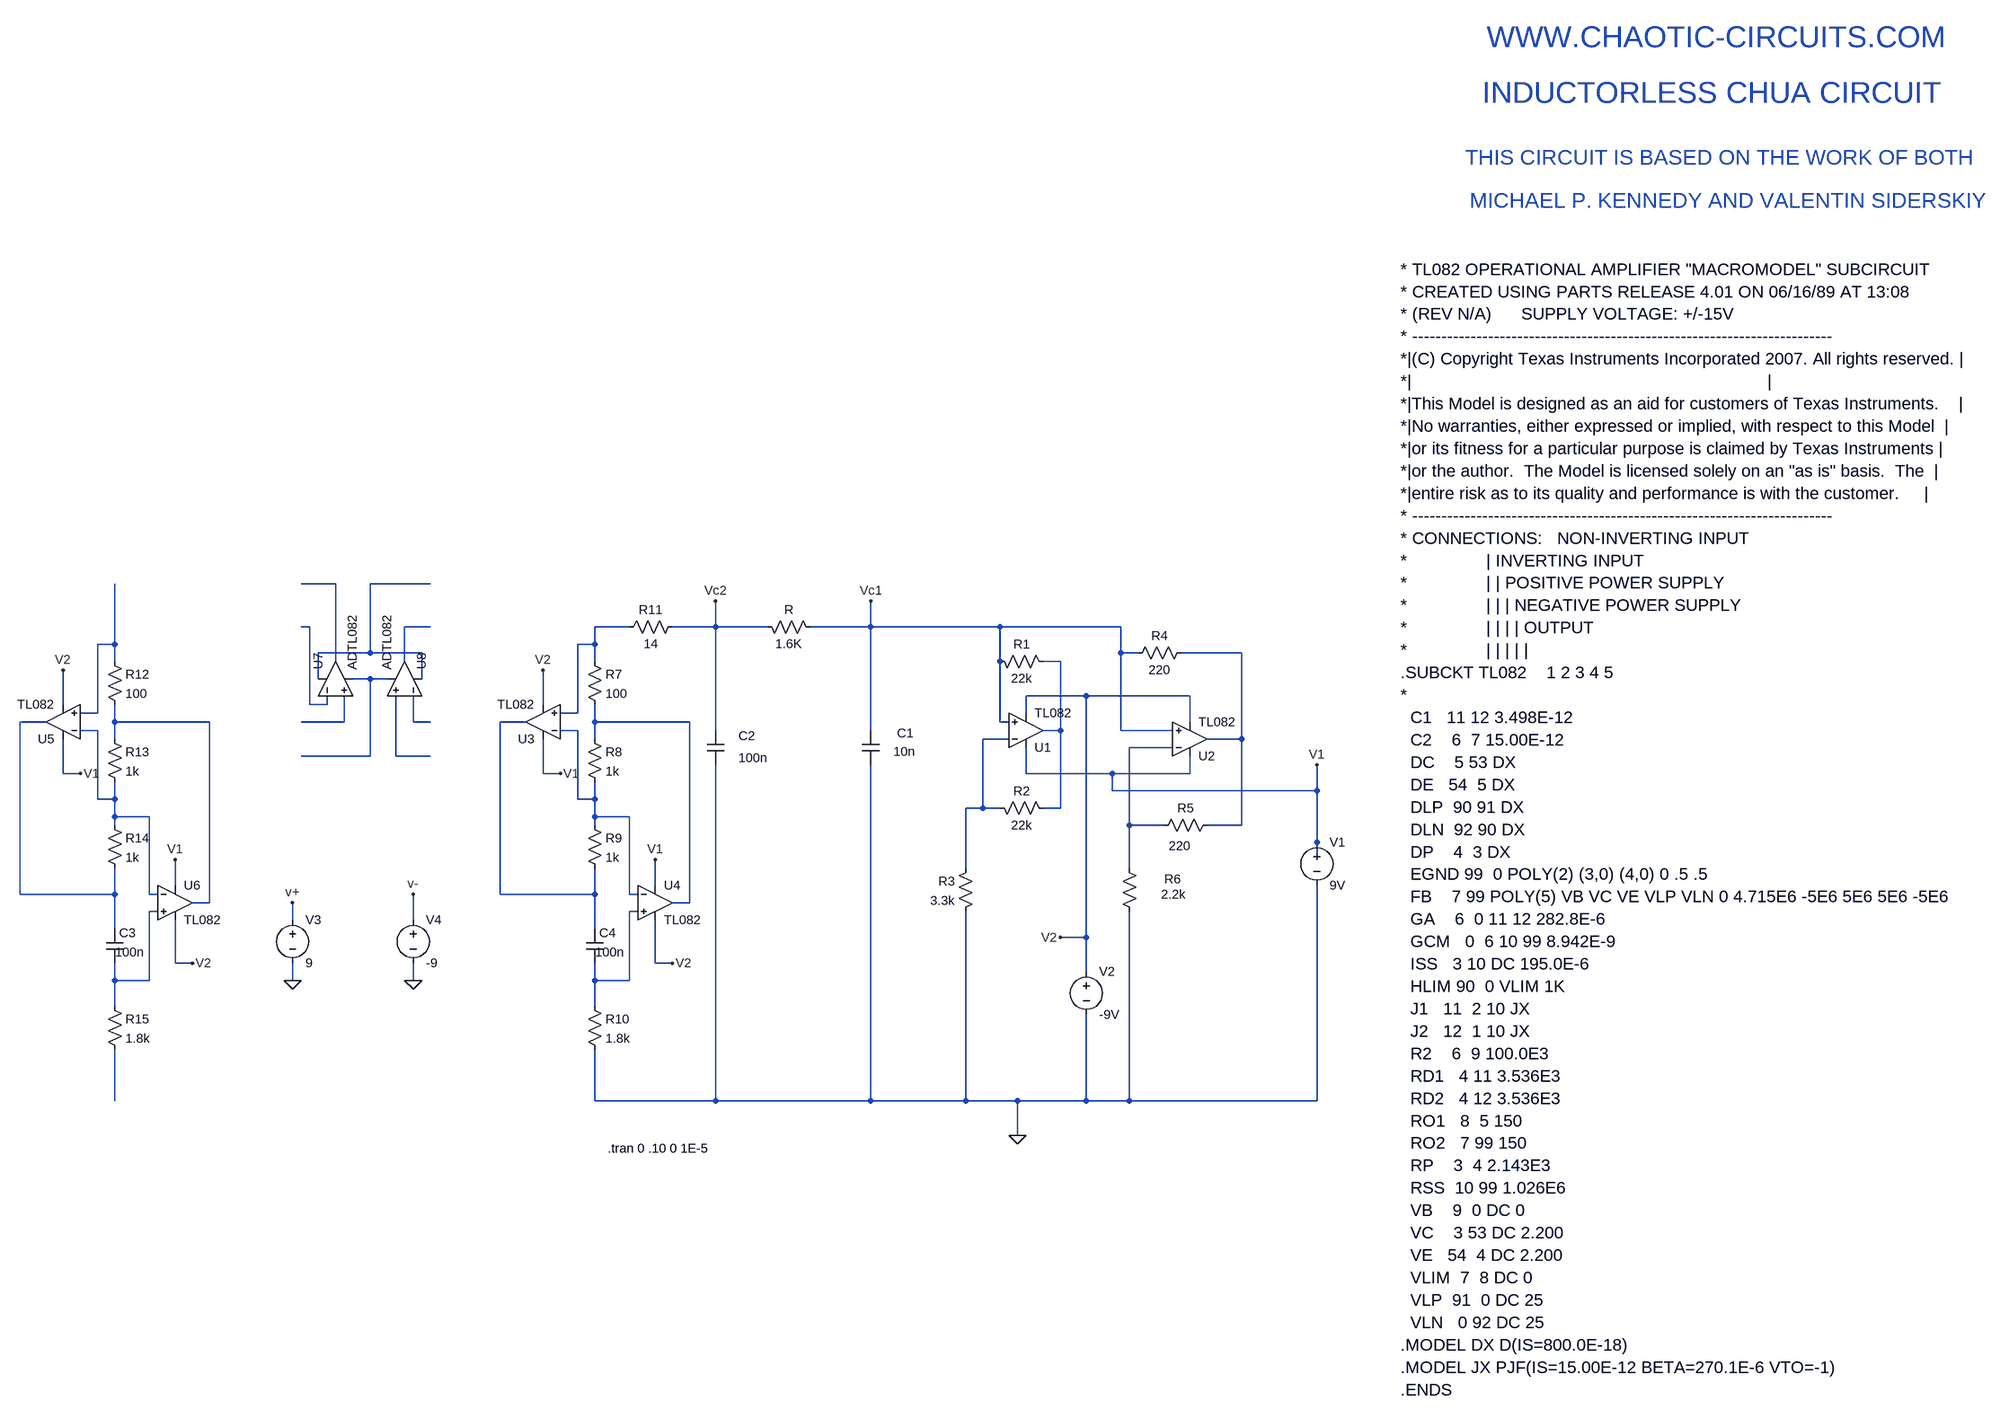
[diagram p0: schematic INDUCTORLESS_CHAU_TL082.asc]
INDUCTORLESS_CHAU_TL082.asc, the LTspice schematic file:
Version 4.1
SHEET 1 1280 2032
WIRE -3520 -208 -3584 -208
WIRE -3344 -208 -3456 -208
WIRE -3568 -128 -3584 -128
WIRE -3344 -128 -3392 -128
WIRE -2400 -128 -2464 -128
WIRE -2240 -128 -2240 -176
WIRE -2240 -128 -2320 -128
WIRE -2144 -128 -2240 -128
WIRE -1952 -128 -1952 -176
WIRE -1952 -128 -2064 -128
WIRE -1712 -128 -1952 -128
WIRE -1488 -128 -1712 -128
WIRE -3968 -96 -3968 -208
WIRE -3968 -96 -4000 -96
WIRE -2464 -96 -2464 -128
WIRE -2464 -96 -2496 -96
WIRE -3456 -80 -3456 -208
WIRE -3456 -80 -3552 -80
WIRE -3360 -80 -3456 -80
WIRE -1488 -80 -1488 -128
WIRE -1456 -80 -1488 -80
WIRE -1264 -80 -1376 -80
WIRE -3968 -64 -3968 -96
WIRE -3520 -64 -3520 -208
WIRE -3392 -64 -3392 -128
WIRE -2464 -64 -2464 -96
WIRE -1712 -64 -1712 -128
WIRE -1600 -64 -1632 -64
WIRE -3552 -32 -3552 -80
WIRE -3456 -32 -3488 -32
WIRE -3424 -32 -3456 -32
WIRE -3360 -32 -3360 -80
WIRE -1552 0 -1664 0
WIRE -1360 0 -1552 0
WIRE -4064 16 -4064 -48
WIRE -3568 16 -3568 -128
WIRE -3536 16 -3536 0
WIRE -3536 16 -3568 16
WIRE -2560 16 -2560 -48
WIRE -4000 32 -4000 -96
WIRE -4000 32 -4032 32
WIRE -2496 32 -2496 -96
WIRE -2496 32 -2528 32
WIRE -1664 32 -1664 0
WIRE -4096 48 -4144 48
WIRE -3968 48 -3968 16
WIRE -3792 48 -3968 48
WIRE -3504 48 -3504 0
WIRE -3504 48 -3584 48
WIRE -3376 48 -3376 0
WIRE -3344 48 -3376 48
WIRE -2592 48 -2640 48
WIRE -2464 48 -2464 16
WIRE -2288 48 -2464 48
WIRE -1712 48 -1712 -64
WIRE -1696 48 -1712 48
WIRE -1360 48 -1360 0
WIRE -4000 64 -4032 64
WIRE -2496 64 -2528 64
WIRE -2240 64 -2240 -128
WIRE -1952 64 -1952 -128
WIRE -1600 64 -1600 -64
WIRE -1600 64 -1632 64
WIRE -1488 64 -1488 -80
WIRE -1392 64 -1488 64
WIRE -3968 80 -3968 48
WIRE -2464 80 -2464 48
WIRE -1696 80 -1744 80
WIRE -1264 80 -1264 -80
WIRE -1264 80 -1328 80
WIRE -1392 96 -1472 96
WIRE -3456 112 -3456 -32
WIRE -3456 112 -3584 112
WIRE -3408 112 -3408 0
WIRE -3344 112 -3408 112
WIRE -4064 144 -4064 80
WIRE -4032 144 -4064 144
WIRE -2560 144 -2560 80
WIRE -2528 144 -2560 144
WIRE -1664 144 -1664 96
WIRE -1504 144 -1664 144
WIRE -1360 144 -1360 112
WIRE -1360 144 -1504 144
WIRE -1504 176 -1504 144
WIRE -1056 176 -1056 128
WIRE -1056 176 -1504 176
WIRE -4000 192 -4000 64
WIRE -3968 192 -3968 160
WIRE -3968 192 -4000 192
WIRE -2496 192 -2496 64
WIRE -2464 192 -2464 160
WIRE -2464 192 -2496 192
WIRE -1744 208 -1744 80
WIRE -1744 208 -1776 208
WIRE -1712 208 -1744 208
WIRE -1600 208 -1600 64
WIRE -1600 208 -1632 208
WIRE -3968 224 -3968 192
WIRE -3904 224 -3968 224
WIRE -2464 224 -2464 192
WIRE -2400 224 -2464 224
WIRE -3968 240 -3968 224
WIRE -2464 240 -2464 224
WIRE -1472 240 -1472 96
WIRE -1408 240 -1472 240
WIRE -1264 240 -1264 80
WIRE -1264 240 -1328 240
WIRE -1056 272 -1056 176
WIRE -1056 304 -1056 272
WIRE -1776 320 -1776 208
WIRE -1472 320 -1472 240
WIRE -3856 352 -3856 304
WIRE -2352 352 -2352 304
WIRE -4144 368 -4144 48
WIRE -3968 368 -3968 320
WIRE -3968 368 -4144 368
WIRE -3904 368 -3904 224
WIRE -3888 368 -3904 368
WIRE -2640 368 -2640 48
WIRE -2464 368 -2464 320
WIRE -2464 368 -2640 368
WIRE -2400 368 -2400 224
WIRE -2384 368 -2400 368
WIRE -3792 384 -3792 48
WIRE -3792 384 -3824 384
WIRE -2288 384 -2288 48
WIRE -2288 384 -2320 384
WIRE -3888 400 -3904 400
WIRE -2384 400 -2400 400
WIRE -3600 416 -3600 384
WIRE -3376 416 -3376 368
WIRE -3968 432 -3968 368
WIRE -2464 432 -2464 368
WIRE -1552 448 -1552 0
WIRE -1552 448 -1600 448
WIRE -3856 496 -3856 416
WIRE -3824 496 -3856 496
WIRE -2352 496 -2352 416
WIRE -2320 496 -2352 496
WIRE -1552 512 -1552 448
WIRE -3968 528 -3968 496
WIRE -3904 528 -3904 400
WIRE -3904 528 -3968 528
WIRE -3600 528 -3600 496
WIRE -3376 528 -3376 496
WIRE -2464 528 -2464 496
WIRE -2400 528 -2400 400
WIRE -2400 528 -2464 528
WIRE -3968 576 -3968 528
WIRE -2464 576 -2464 528
WIRE -3968 752 -3968 656
WIRE -2464 752 -2464 656
WIRE -2240 752 -2240 128
WIRE -2240 752 -2464 752
WIRE -1952 752 -1952 128
WIRE -1952 752 -2240 752
WIRE -1776 752 -1776 400
WIRE -1776 752 -1952 752
WIRE -1680 752 -1776 752
WIRE -1552 752 -1552 592
WIRE -1552 752 -1680 752
WIRE -1472 752 -1472 400
WIRE -1472 752 -1552 752
WIRE -1056 752 -1056 352
WIRE -1056 752 -1472 752
WIRE -1680 816 -1680 752
FLAG -1680 816 0
FLAG -1952 -176 Vc1
FLAG -2240 -176 Vc2
FLAG -1056 128 V1
FLAG -1600 448 V2
FLAG -4064 -48 V2
FLAG -3824 496 V2
FLAG -4032 144 V1
FLAG -3856 304 V1
FLAG -3600 528 0
FLAG -3376 528 0
FLAG -3600 384 v+
FLAG -3376 368 v-
FLAG -2560 -48 V2
FLAG -2320 496 V2
FLAG -2528 144 V1
FLAG -2352 304 V1
SYMBOL res -1472 -64 R270
WINDOW 0 32 56 VTop 2
WINDOW 3 0 56 VBottom 2
SYMATTR InstName R4
SYMATTR Value 220
SYMATTR SpiceLine tol=5 pwr=1
SYMBOL res -1424 256 R270
WINDOW 0 32 56 VTop 2
WINDOW 3 -7 45 VBottom 2
SYMATTR InstName R5
SYMATTR Value 220
SYMATTR SpiceLine tol=5 pwr=1
SYMBOL res -1488 304 R0
WINDOW 0 81 36 Left 2
WINDOW 3 75 64 Left 2
SYMATTR InstName R6
SYMATTR Value 2.2k
SYMATTR SpiceLine tol=5 pwr=1
SYMBOL res -1616 -48 M270
WINDOW 0 32 56 VTop 2
WINDOW 3 0 56 VBottom 2
SYMATTR InstName R1
SYMATTR Value 22k
SYMATTR SpiceLine tol=5 pwr=1
SYMBOL res -1616 224 M270
WINDOW 0 32 56 VTop 2
WINDOW 3 0 56 VBottom 2
SYMATTR InstName R2
SYMATTR Value 22k
SYMATTR SpiceLine tol=5 pwr=1
SYMBOL res -1760 304 M0
SYMATTR InstName R3
SYMATTR Value 3.3k
SYMATTR SpiceLine tol=5 pwr=1
SYMBOL res -2048 -112 M270
WINDOW 0 32 56 VTop 2
WINDOW 3 0 56 VBottom 2
SYMATTR InstName R
SYMATTR Value 1.6K
SYMATTR SpiceLine tol=5 pwr=1
SYMBOL cap -1968 64 R0
WINDOW 0 65 5 Left 2
WINDOW 3 58 39 Left 2
SYMATTR InstName C1
SYMATTR Value 10n
SYMATTR SpiceLine V=100
SYMBOL cap -2256 64 R0
WINDOW 0 59 10 Left 2
WINDOW 3 59 51 Left 2
SYMATTR InstName C2
SYMATTR Value 100n
SYMATTR SpiceLine V=100
SYMBOL voltage -1056 256 R0
WINDOW 123 0 0 Left 2
WINDOW 39 24 124 Left 2
SYMATTR InstName V1
SYMATTR Value 9V
SYMBOL voltage -1552 496 R0
WINDOW 123 0 0 Left 2
WINDOW 39 24 124 Left 2
SYMATTR InstName V2
SYMATTR Value -9V
SYMBOL Opamps\\opamp2 -1664 128 M180
SYMATTR InstName U1
SYMATTR Value TL082
SYMBOL Opamps\\opamp2 -1360 144 M180
SYMATTR InstName U2
SYMATTR Value TL082
SYMBOL res -2304 -144 R90
WINDOW 0 0 56 VBottom 2
WINDOW 3 32 56 VTop 2
SYMATTR InstName R11
SYMATTR Value 14
SYMBOL OpAmps\\ADTL082 -3584 -32 R270
SYMATTR InstName U7
SYMBOL OpAmps\\ADTL082 -3328 -32 M270
SYMATTR InstName U8
SYMBOL res -3984 -80 R0
SYMATTR InstName R12
SYMATTR Value 100
SYMBOL res -3984 64 R0
SYMATTR InstName R13
SYMATTR Value 1k
SYMBOL res -3984 224 R0
SYMATTR InstName R14
SYMATTR Value 1k
SYMBOL res -3984 560 R0
SYMATTR InstName R15
SYMATTR Value 1.8k
SYMBOL cap -3984 432 R0
WINDOW 3 17 44 Left 2
SYMATTR Value 100n
SYMATTR InstName C3
SYMBOL Opamps\\opamp2 -4064 112 R180
SYMATTR InstName U5
SYMATTR Value TL082
SYMBOL Opamps\\opamp2 -3856 320 R0
SYMATTR InstName U6
SYMATTR Value TL082
SYMBOL voltage -3600 400 R0
WINDOW 123 0 0 Left 0
WINDOW 39 0 0 Left 0
SYMATTR InstName V3
SYMATTR Value 9
SYMBOL voltage -3376 400 R0
WINDOW 123 0 0 Left 0
WINDOW 39 0 0 Left 0
SYMATTR InstName V4
SYMATTR Value -9
SYMBOL res -2480 -80 R0
SYMATTR InstName R7
SYMATTR Value 100
SYMBOL res -2480 64 R0
SYMATTR InstName R8
SYMATTR Value 1k
SYMBOL res -2480 224 R0
SYMATTR InstName R9
SYMATTR Value 1k
SYMBOL res -2480 560 R0
SYMATTR InstName R10
SYMATTR Value 1.8k
SYMBOL cap -2480 432 R0
WINDOW 3 17 44 Left 2
SYMATTR Value 100n
SYMATTR InstName C4
SYMBOL Opamps\\opamp2 -2560 112 R180
SYMATTR InstName U3
SYMATTR Value TL082
SYMBOL Opamps\\opamp2 -2352 320 R0
SYMATTR InstName U4
SYMATTR Value TL082
TEXT -2440 840 Left 2 !.tran 0 .10 0 1E-5
TEXT -384 -1272 Left 5 ;WWW.CHAOTIC-CIRCUITS.COM
TEXT -544 -792 Left 3 !* TL082 OPERATIONAL AMPLIFIER "MACROMODEL" SUBCIRCUIT\n* CREATED USING PARTS RELEASE 4.01 ON 06/16/89 AT 13:08\n* (REV N/A)      SUPPLY VOLTAGE: +/-15V\n* ------------------------------------------------------------------------\n*|(C) Copyright Texas Instruments Incorporated 2007. All rights reserved. |\n*|                                                                        |\n*|This Model is designed as an aid for customers of Texas Instruments.    |\n*|No warranties, either expressed or implied, with respect to this Model  |\n*|or its fitness for a particular purpose is claimed by Texas Instruments |\n*|or the author.  The Model is licensed solely on an "as is" basis.  The  |\n*|entire risk as to its quality and performance is with the customer.     |\n* ------------------------------------------------------------------------\n* CONNECTIONS:   NON-INVERTING INPUT\n*                | INVERTING INPUT\n*                | | POSITIVE POWER SUPPLY\n*                | | | NEGATIVE POWER SUPPLY\n*                | | | | OUTPUT\n*                | | | | |\n.SUBCKT TL082    1 2 3 4 5\n*\n  C1   11 12 3.498E-12\n  C2    6  7 15.00E-12\n  DC    5 53 DX\n  DE   54  5 DX\n  DLP  90 91 DX\n  DLN  92 90 DX\n  DP    4  3 DX\n  EGND 99  0 POLY(2) (3,0) (4,0) 0 .5 .5\n  FB    7 99 POLY(5) VB VC VE VLP VLN 0 4.715E6 -5E6 5E6 5E6 -5E6\n  GA    6  0 11 12 282.8E-6\n  GCM   0  6 10 99 8.942E-9\n  ISS   3 10 DC 195.0E-6\n  HLIM 90  0 VLIM 1K\n  J1   11  2 10 JX\n  J2   12  1 10 JX\n  R2    6  9 100.0E3\n  RD1   4 11 3.536E3\n  RD2   4 12 3.536E3\n  RO1   8  5 150\n  RO2   7 99 150\n  RP    3  4 2.143E3\n  RSS  10 99 1.026E6\n  VB    9  0 DC 0\n  VC    3 53 DC 2.200\n  VE   54  4 DC 2.200\n  VLIM  7  8 DC 0\n  VLP  91  0 DC 25\n  VLN   0 92 DC 25\n.MODEL DX D(IS=800.0E-18)\n.MODEL JX PJF(IS=15.00E-12 BETA=270.1E-6 VTO=-1)\n.ENDS
TEXT -392 -1168 Left 5 ;INDUCTORLESS CHUA CIRCUIT
TEXT -424 -1048 Left 4 ;THIS CIRCUIT IS BASED ON THE WORK OF BOTH
TEXT -416 -968 Left 4 ;MICHAEL P. KENNEDY AND VALENTIN SIDERSKIY

The netlist it stands for:
* INDUCTORLESS_CHAU_TL082.asc
R4 Vc1 N007 220 tol=5 pwr=1
R5 N019 N007 220 tol=5 pwr=1
R6 N019 0 2.2k tol=5 pwr=1
R1 N008 Vc1 22k tol=5 pwr=1
R2 N008 N018 22k tol=5 pwr=1
R3 N018 0 3.3k tol=5 pwr=1
R Vc1 Vc2 1.6K tol=5 pwr=1
C1 Vc1 0 10n V=100
C2 Vc2 0 100n V=100
V1 V1 0 9V
V2 V2 0 -9V
X§U1 Vc1 N018 V1 V2 N008 TL082  ; pins In+ In- V+ V- OUT
X§U2 Vc1 N019 V1 V2 N007 TL082  ; pins In+ In- V+ V- OUT
R11 Vc2 N005 14
X§U7 N012 N003 N002 N009 N001 ADTL082  ; pins In+ In- V+ V- OUT
X§U8 N020 N013 N002 N009 N004 ADTL082  ; pins In+ In- V+ V- OUT
R12 N006 N011 100
R13 N011 N016 1k
R14 N016 N010 1k
R15 N021 N023 1.8k
C3 N010 N021 100n
X§U5 N006 N016 V1 V2 N010 TL082  ; pins In+ In- V+ V- OUT
X§U6 N021 N016 V1 V2 N011 TL082  ; pins In+ In- V+ V- OUT
V3 v+ 0 9
V4 v- 0 -9
R7 N005 N015 100
R8 N015 N017 1k
R9 N017 N014 1k
R10 N022 0 1.8k
C4 N014 N022 100n
X§U3 N005 N017 V1 V2 N014 TL082  ; pins In+ In- V+ V- OUT
X§U4 N022 N017 V1 V2 N015 TL082  ; pins In+ In- V+ V- OUT
.tran 0 .10 0 1E-5
* WWW.CHAOTIC-CIRCUITS.COM
* TL082 OPERATIONAL AMPLIFIER "MACROMODEL" SUBCIRCUIT
* CREATED USING PARTS RELEASE 4.01 ON 06/16/89 AT 13:08
* (REV N/A)      SUPPLY VOLTAGE: +/-15V
* ------------------------------------------------------------------------
*|(C) Copyright Texas Instruments Incorporated 2007. All rights reserved. |
*|                                                                        |
*|This Model is designed as an aid for customers of Texas Instruments.    |
*|No warranties, either expressed or implied, with respect to this Model  |
*|or its fitness for a particular purpose is claimed by Texas Instruments |
*|or the author.  The Model is licensed solely on an "as is" basis.  The  |
*|entire risk as to its quality and performance is with the customer.     |
* ------------------------------------------------------------------------
* CONNECTIONS:   NON-INVERTING INPUT
*                | INVERTING INPUT
*                | | POSITIVE POWER SUPPLY
*                | | | NEGATIVE POWER SUPPLY
*                | | | | OUTPUT
*                | | | | |
.SUBCKT TL082    1 2 3 4 5
*
  C1   11 12 3.498E-12
  C2    6  7 15.00E-12
  DC    5 53 DX
  DE   54  5 DX
  DLP  90 91 DX
  DLN  92 90 DX
  DP    4  3 DX
  EGND 99  0 POLY(2) (3,0) (4,0) 0 .5 .5
  FB    7 99 POLY(5) VB VC VE VLP VLN 0 4.715E6 -5E6 5E6 5E6 -5E6
  GA    6  0 11 12 282.8E-6
  GCM   0  6 10 99 8.942E-9
  ISS   3 10 DC 195.0E-6
  HLIM 90  0 VLIM 1K
  J1   11  2 10 JX
  J2   12  1 10 JX
  R2    6  9 100.0E3
  RD1   4 11 3.536E3
  RD2   4 12 3.536E3
  RO1   8  5 150
  RO2   7 99 150
  RP    3  4 2.143E3
  RSS  10 99 1.026E6
  VB    9  0 DC 0
  VC    3 53 DC 2.200
  VE   54  4 DC 2.200
  VLIM  7  8 DC 0
  VLP  91  0 DC 25
  VLN   0 92 DC 25
.MODEL DX D(IS=800.0E-18)
.MODEL JX PJF(IS=15.00E-12 BETA=270.1E-6 VTO=-1)
.ENDS
* INDUCTORLESS CHUA CIRCUIT
* THIS CIRCUIT IS BASED ON THE WORK OF BOTH
* MICHAEL P. KENNEDY AND VALENTIN SIDERSKIY
.lib ADI.lib
.backanno
.end